# EAGLE design ring-modulator-v3.0 (EAGLE 9.6.2)
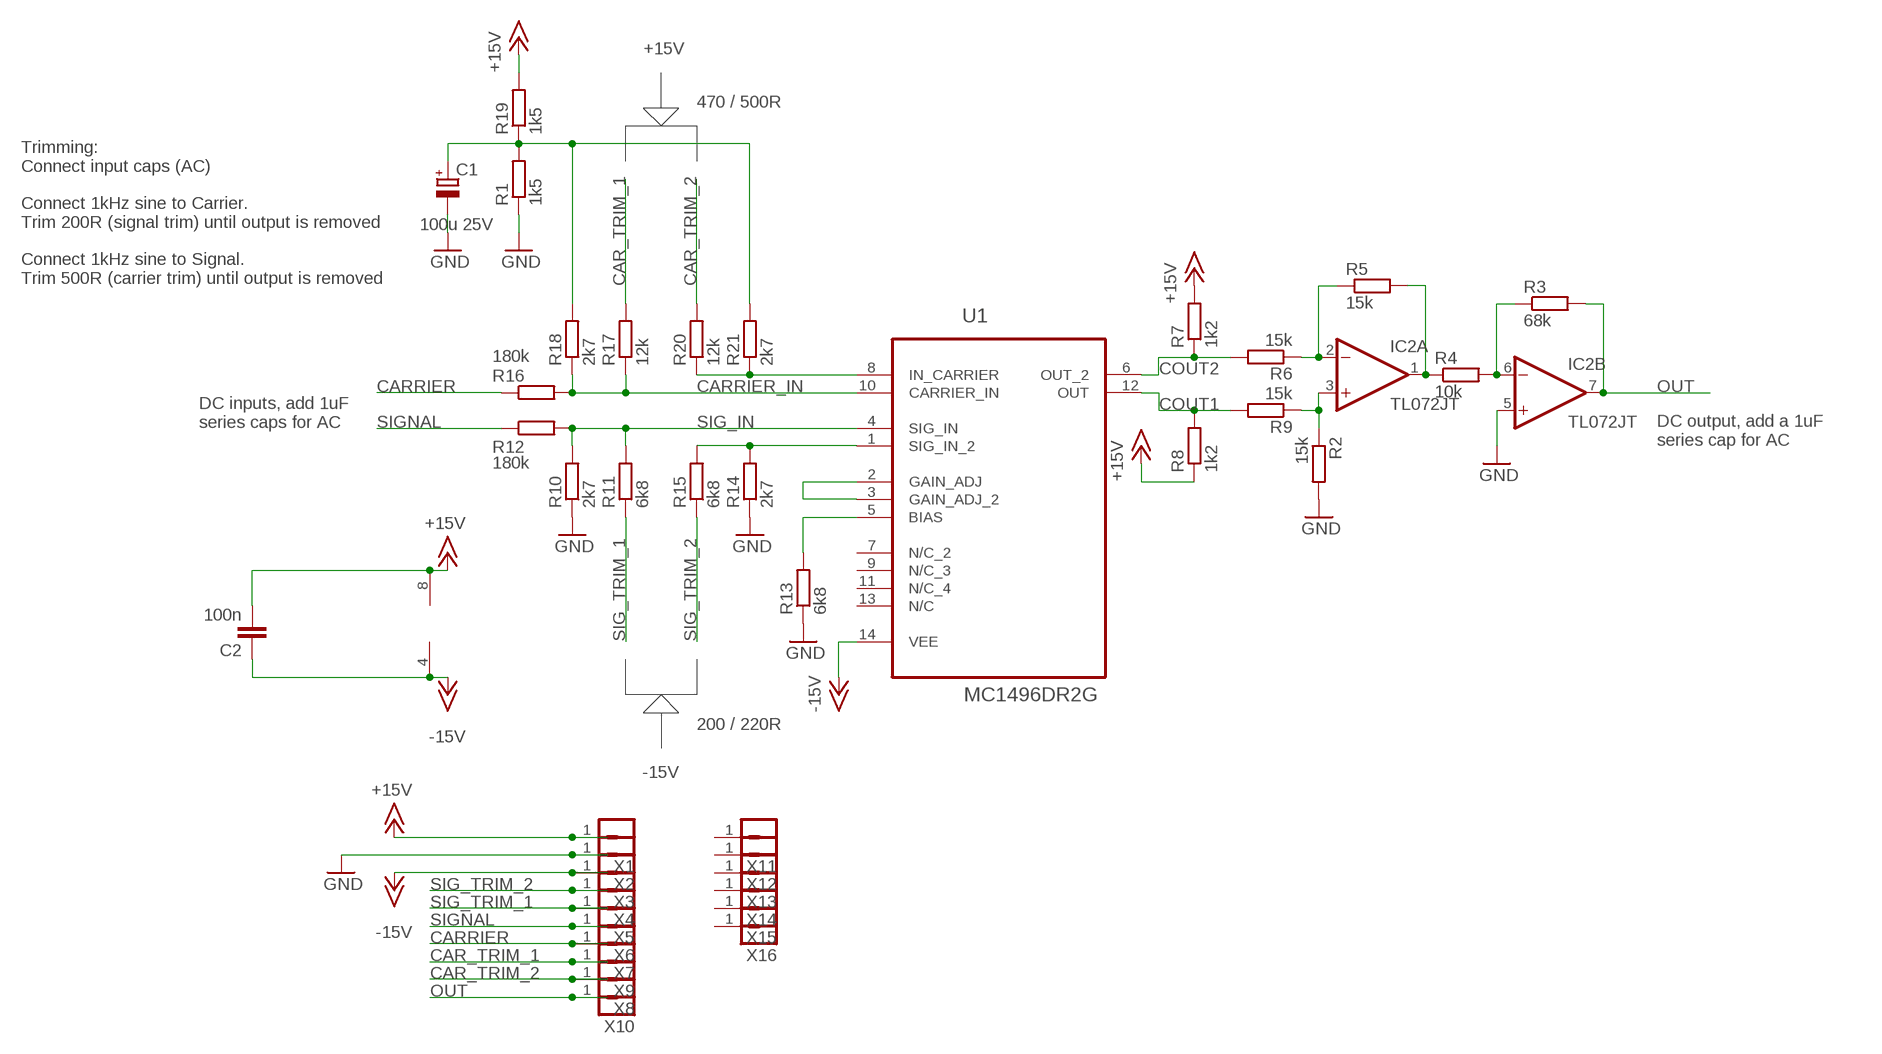
[diagram p0: schematic, sheet 1]

## Parts
C1  100u 25V  CPOL-EUUD-4X5,8  [UD-4X5,8_NICHICON]
C2  100n  C-EUC0603  [C0603]
IC2  TL072JT  [TSSOP8J]
R1  1k5  R-EU_R0402  [R0402]
R2  15k  R-EU_R0402  [R0402]
R3  68k  R-EU_R0402  [R0402]
R4  10k  R-EU_R0402  [R0402]
R5  15k  R-EU_R0402  [R0402]
R6  15k  R-EU_R0402  [R0402]
R7  1k2  R-EU_R0402  [R0402]
R8  1k2  R-EU_R0402  [R0402]
R9  15k  R-EU_R0402  [R0402]
R10  2k7  R-EU_R0402  [R0402]
R11  6k8  R-EU_R0402  [R0402]
R12  180k  R-EU_R0402  [R0402]
R13  6k8  R-EU_R0402  [R0402]
R14  2k7  R-EU_R0402  [R0402]
R15  6k8  R-EU_R0402  [R0402]
R16  180k  R-EU_R0402  [R0402]
R17  12k  R-EU_R0402  [R0402]
R18  2k7  R-EU_R0402  [R0402]
R19  1k5  R-EU_R0402  [R0402]
R20  12k  R-EU_R0402  [R0402]
R21  2k7  R-EU_R0402  [R0402]
U1  MC1496DR2G  [SOIC127P600X175-14N]
X1  MA01-1JN  [MA01N-1J]
X2  MA01-1JN  [MA01N-1J]
X3  MA01-1JN  [MA01N-1J]
X4  MA01-1JN  [MA01N-1J]
X5  MA01-1JN  [MA01N-1J]
X6  MA01-1JN  [MA01N-1J]
X7  MA01-1JN  [MA01N-1J]
X8  MA01-1JN  [MA01N-1J]
X9  MA01-1JN  [MA01N-1J]
X10  MA01-1JN  [MA01N-1J]
X11  MA01-1JN  [MA01N-1J]
X12  MA01-1JN  [MA01N-1J]
X13  MA01-1JN  [MA01N-1J]
X14  MA01-1JN  [MA01N-1J]
X15  MA01-1JN  [MA01N-1J]
X16  MA01-1JN  [MA01N-1J]

## Nets
+15V: C2.2 IC2.8(P:V+) R7.2 R8.1 R19.2 X1.1
-15V: C2.1 IC2.4(P:V-) U1.14(VEE) X3.1
CAR_TRIM_1: R17.2 X9.1
CAR_TRIM_2: R20.2 X8.1
CARRIER: R16.1 X7.1
CARRIER_IN: R16.2 R17.1 R18.1 U1.10(CARRIER_IN)
COUT1: R8.2 R9.2 U1.12(OUT)
COUT2: R6.2 R7.1 U1.6(OUT_2)
GND: C1.- IC2.5(B:+IN) R1.1 R2.2 R10.1 R13.1 R14.1 X2.1
N$3: R14.2 R15.2 U1.1(SIG_IN_2)
N$8: R20.1 R21.1 U1.8(IN_CARRIER)
N$9: C1.+ R1.2 R18.2 R19.1 R21.2
N$11: R13.2 U1.5(BIAS)
N$12: U1.2(GAIN_ADJ) U1.3(GAIN_ADJ_2)
N$15: IC2.3(A:+IN) R2.1 R9.1
N$16: IC2.2(A:-IN) R5.1 R6.1
N$17: IC2.1(A:OUT) R4.1 R5.2
N$18: IC2.6(B:-IN) R3.1 R4.2
OUT: IC2.7(B:OUT) R3.2 X10.1
SIG_IN: R10.2 R11.2 R12.2 U1.4(SIG_IN)
SIG_TRIM_1: R11.1 X5.1
SIG_TRIM_2: R15.1 X4.1
SIGNAL: R12.1 X6.1
Unconnected: U1.7(N/C_2) U1.9(N/C_3) U1.11(N/C_4) U1.13(N/C) X11.1 X12.1 X13.1 X14.1 X15.1 X16.1

## Notes on the sheet
- +15V
- 470 / 500R
- Trimming:
  Connect input caps (AC)
  
  Connect 1kHz sine to Carrier. 
  Trim 200R (signal trim) until output is removed
  
  Connect 1kHz sine to Signal. 
  Trim 500R (carrier trim) until output is removed
- DC inputs, add 1uF 
  series caps for AC
- DC output, add a 1uF 
  series cap for AC
- 200 / 220R
- -15V

## Library data of the parts
C1 = rcl:CPOL-EU: POLARIZED CAPACITOR, European symbol; SPICEPREFIX: C
C2 = rcl:C-EU: CAPACITOR, European symbol; SPICEPREFIX: C
IC2 = joakim:TL072J: OP AMP
R1-R21 = rcl:R-EU_: RESISTOR, European symbol; SPICEPREFIX: R
U1 = ON Semiconductor_By_element14_Batch_1:MC1496DR2G: Balanced Modulators/Demodulators; MPN: MC1496DR2G; OC_FARNELL: 1651904; OC_NEWARK: 45J1148; PACKAGE: SOIC-14; SUPPLIER: ON SEMICONDUCTOR
X1-X16 = joakim:MA01-1J: PIN HEADER

## Board
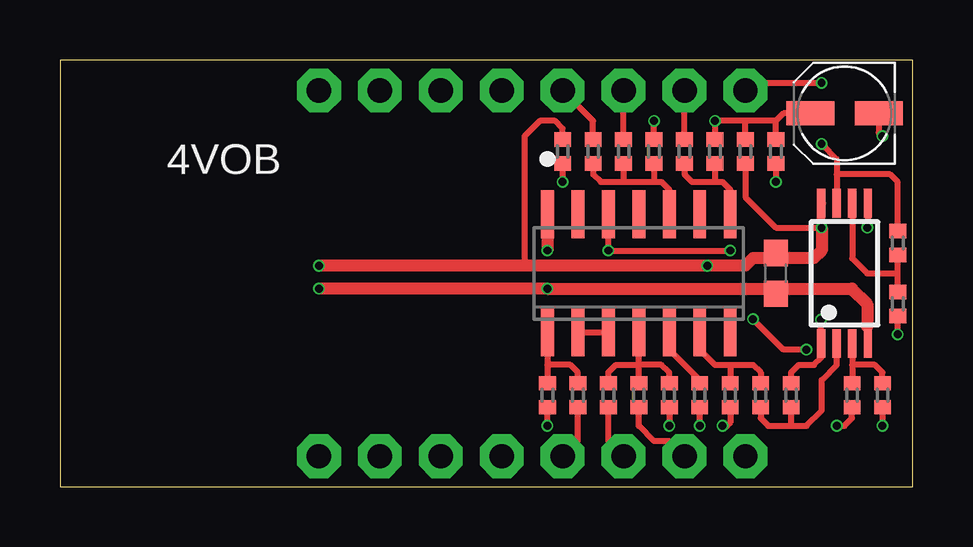
[diagram p1: board, top side]
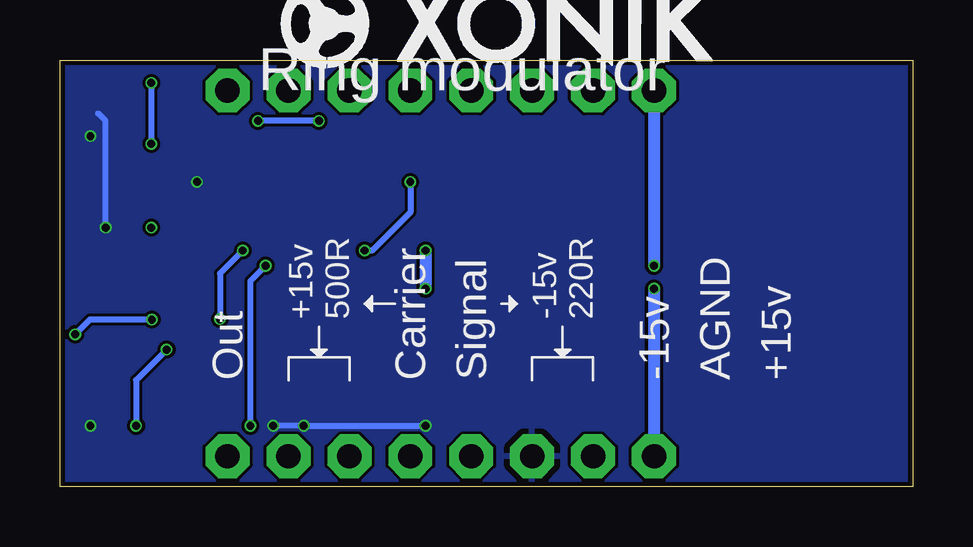
[diagram p2: board, bottom side, seen from below]

Size 35.56 x 17.78 mm. Coordinates in mm from the lower left corner, seen from the top.
Outline: 0,0 35.56,0 35.56,17.78 0,17.78 0,0
Copper layers (1*16): Top 0.035mm / dielectric 1.6mm / Bottom 0.035mm
Design rules "jlcpcb-2layers": minimum track width 5mil, minimum drill 0.3mm, track to track 5mil, track to pad 5mil, pad to pad 5mil, via to via 5mil, smd to smd 5mil, copper to edge 0.2mm, drill to drill 6mil, minimum pad ring 10mil, minimum via ring 3mil, stop-mask expansion 4mil, vias tented up to drill 0mil, thermal gap 10mil

### Footprints (pad centres in the part's own frame; a part is rotated, then mirrored left to right if it is on the bottom)
UD-4X5,8_NICHICON = smd 2 x 1: + 1.425,0; - -1.425,0
C0603 = smd 1.1 x 1: 1 -0.85,0; 2 0.85,0
TSSOP8J = smd 1.2 x 0.35: 1 -2.925,0.975; 2 -2.925,0.325; 3 -2.925,-0.325; 4 -2.925,-0.975; 5 2.925,-0.975; 6 2.925,-0.325; 7 2.925,0.325; 8 2.925,0.975
R0402 = smd 0.6 x 0.7: 1 -0.5,0; 2 0.5,0
SOIC127P600X175-14N = smd 1.981 x 0.533: 1 -2.464,3.81; 2 -2.464,2.54; 3 -2.464,1.27; 4 -2.464,0; 5 -2.464,-1.27; 6 -2.464,-2.54; 7 -2.464,-3.81; 8 2.464,-3.81; 9 2.464,-2.54; 10 2.464,-1.27; 11 2.464,0; 12 2.464,1.27; 13 2.464,2.54; 14 2.464,3.81
MA01N-1J = drill 1.016 octagon: 1 0,0

### Placement (x,y rotation side)
C1  32.7,15.56 180 top
C2  29.84,8.89 90 top
IC2  32.7,8.89 90 top
R1  29.84,13.97 90 top
R2  34.29,3.81 270 top
R3  34.92,10.16 90 top
R4  34.92,7.62 90 top
R5  30.48,3.81 90 top
R6  29.21,3.81 90 top
R7  27.94,3.81 270 top
R8  20.95,13.97 270 top
R9  33.02,3.81 270 top
R10  25.4,3.81 90 top
R11  22.86,3.81 90 top
R12  24.13,3.81 90 top
R13  26.67,3.81 90 top
R14  20.32,3.81 90 top
R15  21.59,3.81 90 top
R16  22.23,13.97 270 top
R17  23.5,13.97 90 top
R18  24.77,13.97 90 top
R19  28.57,13.97 270 top
R20  26.04,13.97 90 top
R21  27.3,13.97 90 top
U1  24.13,8.89 90 top
U$3  [XONIK_LOGO_18]  26.35,17.46 0 bottom
X1  10.79,16.51 0 top
X2  15.88,1.27 0 top
X3  10.79,1.27 0 top
X4  20.95,1.27 0 top
X5  23.5,1.27 0 top
X6  26.04,1.27 0 top
X7  20.95,16.51 0 top
X8  26.04,16.51 0 top
X9  23.5,16.51 0 top
X10  28.57,16.51 0 top
X11  13.34,16.51 0 top
X12  13.34,1.27 0 top
X13  18.41,16.51 0 top
X14  28.57,1.27 0 top
X15  15.88,16.51 0 top
X16  18.41,1.27 0 top

### Tracks (layer width: path | path; a pad name or v marks a point on that pad's centre or on a via)
+15V  (via drill 0.33)
  Top 0.254: R8.1 20.95,14.92 20.64,15.24 20,15.24 19.37,14.61 19.37,9.21 | 31.73,10.82 31.7,10.79 29.84,10.79 28.57,12.06 R19.2 | v27.62,2.54 27.8,2.54 27.94,2.67 R7.2
  Top 0.356: 31.75,11.79 IC2.8 31.73,10.82 v31.75,10.79
  Top 0.508: v10.79,9.21 19.37,9.21 v26.99,9.21 28.57,9.21 28.89,9.53 29.63,9.53 C2.2 30.06,9.53 31.43,9.53 31.75,9.84 v31.75,10.79
  Bottom 0.254: v27.62,2.54 27.62,8.57 v26.99,9.21
  Bottom 0.508: X1.1 v10.79,9.21
-15V  (via drill 0.33)
  Top 0.254: 33.66,6.67 33.66,5.99 IC2.4
  Top 0.508: U1.14 v20.32,9.84 | v10.79,8.26 v20.32,8.26 29.63,8.26 C2.1 30.06,8.26 33.02,8.26 33.66,7.62 33.66,6.67
  Bottom 0.508: v20.32,9.84 v20.32,8.26 | v10.79,8.26 X3.1
CAR_TRIM_1
  Top 0.254: R17.2 X9.1
CAR_TRIM_2
  Top 0.254: R20.2 X8.1
CARRIER
  Top 0.254: R16.1 22.23,15.24 X7.1
CARRIER_IN
  Top 0.254: R16.2 22.23,13.02 22.54,12.7 23.5,12.7 | 23.5,12.7 24.77,12.7 | 24.77,12.7 25.08,12.7 25.4,12.38 U1.10 | R18.1 24.77,12.7 | R17.1 23.5,12.7
COUT1  (via drill 0.33)
  Top 0.254: R9.2 33.02,2.86 32.7,2.54 v32.38,2.54 | v28.89,6.99 30.16,5.71 v31.11,5.71 | R8.2 v20.95,12.7 | U1.12 v22.86,9.84 v27.94,9.84
  Bottom 0.254: v31.11,5.71 32.38,4.45 v32.38,2.54 | v20.95,12.7 20.95,11.43 22.54,9.84 v22.86,9.84 | v27.94,9.84 28.89,8.89 v28.89,6.99
COUT2
  Top 0.254: U1.6 26.67,5.71 27.3,5.08 27.94,5.08 | R6.2 29.21,4.76 28.89,5.08 27.94,5.08 | 27.94,5.08 R7.1
GND  (via drill 0.33)
  Top 0.254: R10.1 v25.4,2.54 | v26.67,2.54 R13.1 | v20.32,2.54 R14.1 | R1.1 v29.84,12.7 | IC2.5 33.68,10.82 v33.66,10.79 | v34.29,14.61 34.13,14.77 C1.- | R2.2 v34.29,2.54
  Bottom 0.254: v26.67,2.54 v25.4,2.54 v20.32,2.54 | v33.66,10.79 33.66,15.24 33.97,15.56
  pour Bottom: -0.95,18.41 36.2,18.41 36.51,18.1 36.51,-1.27 36.2,-1.59 -0.95,-1.59
N$3
  Top 0.254: U1.1 20.32,5.08 | 20.32,5.08 R14.2 | R15.2 21.59,4.76 21.27,5.08 20.32,5.08
N$8
  Top 0.254: R20.1 26.04,13.02 26.35,12.7 27.3,12.7 | 27.3,12.7 27.62,12.7 27.94,12.38 U1.8 | R21.1 27.3,12.7
N$9  (via drill 0.33)
  Top 0.254: R1.2 29.84,15.24 | 29.84,15.24 28.57,15.24 | 28.57,15.24 v27.3,15.24 R21.2 | R19.1 28.57,15.24 | R18.2 v24.77,15.24 | C1.+ 30.16,15.56 29.84,15.24
  Bottom 0.254: v24.77,15.24 v27.3,15.24
N$11
  Top 0.254: U1.5 25.4,5.71 26.67,4.45 R13.2
N$12
  Top 0.254: U1.2 U1.3
N$15
  Top 0.254: IC2.3 33.03,5.08 | 33.03,5.08 R9.1 | R2.1 34.29,4.76 33.97,5.08 33.03,5.08
N$16
  Top 0.254: R6.1 29.21,2.86 29.53,2.54 30.48,2.54 | 30.48,2.54 R5.1 | 30.48,2.54 31.11,2.54 31.75,3.17 31.75,4.45 32.38,5.07 IC2.2
N$17  (via drill 0.33)
  Top 0.254: v31.73,6.96 IC2.1 31.75,5.94 31.75,5.4 31.43,5.08 30.8,5.08 30.48,4.76 R5.2 | v34.92,6.35 R4.1
  Bottom 0.254: v31.73,6.96 34.31,6.96 v34.92,6.35
N$18
  Top 0.254: IC2.6 33.03,9.52 33.66,8.89 34.92,8.89 | R4.2 34.92,8.89 | 34.92,8.89 R3.1
OUT  (via drill 0.33)
  Top 0.254: R3.2 34.92,12.7 34.61,13.02 32.38,13.02 | IC2.7 32.38,13.01 32.38,13.02 | X10.1 28.89,16.83 v31.75,16.83 | v31.75,14.29 32.38,13.65 32.38,13.02
  Bottom 0.254: v31.75,16.83 v31.75,14.29
SIG_IN
  Top 0.254: R11.2 22.86,4.76 23.18,5.08 24.13,5.08 | 24.13,5.08 U1.4 | R12.2 24.13,5.08 | R10.2 25.4,4.76 25.08,5.08 24.13,5.08
  Top 0.305: U1.4 24.05,6.43
SIG_TRIM_1
  Top 0.254: X5.1 22.86,1.91 R11.1
SIG_TRIM_2
  Top 0.254: X4.1 21.59,1.91 R15.1
SIGNAL
  Top 0.254: X6.1 25.4,1.91 24.77,1.91 24.13,2.54 R12.1

### Text on the board
tNames: 4VOB
bNames: Ring modulator | -15v / 220R | +15v / 500R | +15v | AGND | -15v | Signal | Carrier | Out